# Altium schematic sheet Relay.SchDoc
size A4
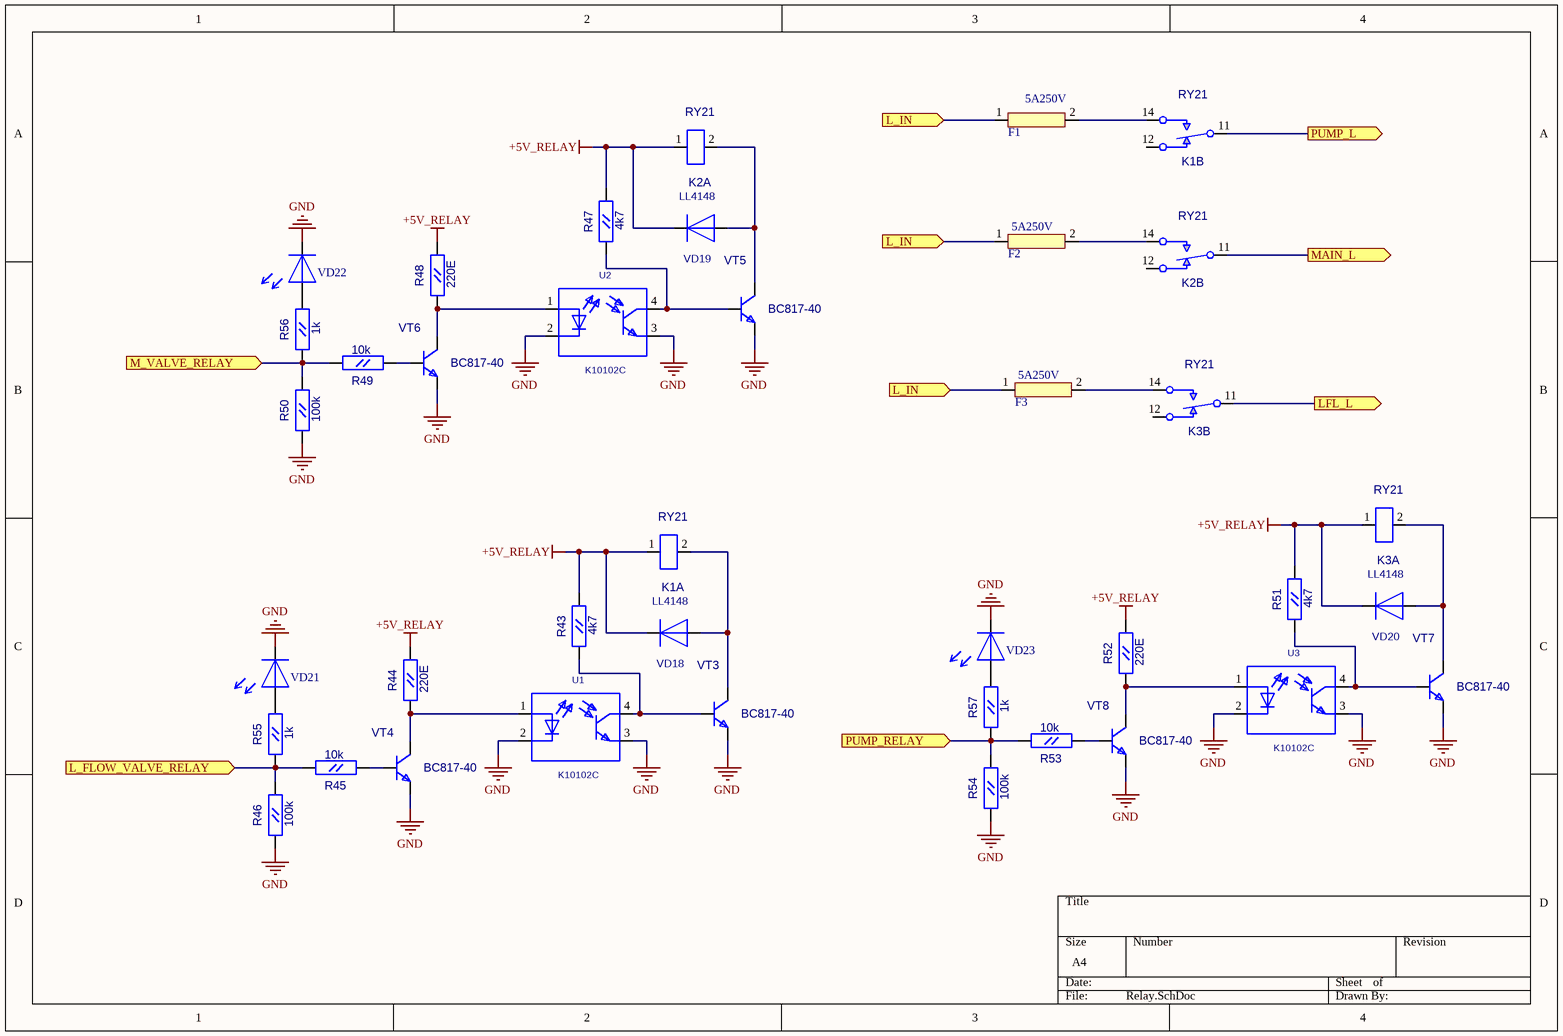
[diagram p0: Relay.SchDoc]

## Parts
F1  KLS5-266(5x20) 2pcs  [Fuse_5x20]  (value not drawn)
F2  KLS5-266(5x20) 2pcs  [Fuse_5x20]  (value not drawn)
F3  KLS5-266(5x20) 2pcs  [Fuse_5x20]  (value not drawn)
K1  RY21  [RY21_RY21(Primary)]  (parts A,B of 2)
K2  RY21  [RY21_RY21(Primary)]  (parts A,B of 2)
K3  RY21  [RY21_RY21(Primary)]  (parts A,B of 2)
R43  4k7  [RC0603]
R44  220E  [RC0603]
R45  10k  [RC0603]
R46  100k  [RC0603]
R47  4k7  [RC0603]
R48  220E  [RC0603]
R49  10k  [RC0603]
R50  100k  [RC0603]
R51  4k7  [RC0603]
R52  220E  [RC0603]
R53  10k  [RC0603]
R54  100k  [RC0603]
R55  1k  [RC0603]
R56  1k  [RC0603]
R57  1k  [RC0603]
U1  K10102C  [PC817]
U2  K10102C  [PC817]
U3  K10102C  [PC817]
VD18  LL4148  [SOD-80]
VD19  LL4148  [SOD-80]
VD20  LL4148  [SOD-80]
VD21  LED_0805  [LED0805]  (value not drawn)
VD22  LED_0805  [LED0805]  (value not drawn)
VD23  LED_0805  [LED0805]  (value not drawn)
VT3  BC817-40  [SOT-23(123)]
VT4  BC817-40  [SOT-23(123)]
VT5  BC817-40  [SOT-23(123)]
VT6  BC817-40  [SOT-23(123)]
VT7  BC817-40  [SOT-23(123)]
VT8  BC817-40  [SOT-23(123)]

## Ports
L_FLOW_VALVE_RELAY (in), L_IN (in), LFL_L (out), M_VALVE_RELAY (in), MAIN_L (out), PUMP_L (out), PUMP_RELAY (in)

## Nets
+5V_RELAY: K1.1(L1) K2.1(L1) K3.1(L1) R43.2(B) R44.2(B) R47.2(B) R48.2(B) R51.2(B) R52.2(B) VD18.2(+) VD19.2(+) VD20.2(+)
GND: R46.1(A) R50.1(A) R54.1(A) U1.2 U1.3 U2.2 U2.3 U3.2 U3.3 VD21.2 VD22.2 VD23.2 VT3.2(E) VT4.2(E) VT5.2(E) VT6.2(E) VT7.2(E) VT8.2(E)
L_FLOW_VALVE_RELAY: R45.2(B) R46.2(B) R55.1(A) ; port L_FLOW_VALVE_RELAY
L_IN: F1.1 F2.1 F3.1 ; port L_IN
LFL_L: K3.11(C1) ; port LFL_L
M_VALVE_RELAY: R49.2(B) R50.2(B) R56.1(A) ; port M_VALVE_RELAY
MAIN_L: K2.11(C1) ; port MAIN_L
PUMP_L: K1.11(C1) ; port PUMP_L
PUMP_RELAY: R53.2(B) R54.2(B) R57.1(A) ; port PUMP_RELAY
NetF1_2: F1.2 K1.14(C2)
NetF2_2: F2.2 K2.14(C2)
NetF3_2: F3.2 K3.14(C2)
NetK1_2: K1.2(C2) VD18.1(-) VT3.3(C)
NetK2_2: K2.2(C2) VD19.1(-) VT5.3(C)
NetK3_2: K3.2(C2) VD20.1(-) VT7.3(C)
NetR43_1: R43.1(A) U1.4 VT3.1(B)
NetR44_1: R44.1(A) U1.1 VT4.3(C)
NetR45_1: R45.1(A) VT4.1(B)
NetR47_1: R47.1(A) U2.4 VT5.1(B)
NetR48_1: R48.1(A) U2.1 VT6.3(C)
NetR49_1: R49.1(A) VT6.1(B)
NetR51_1: R51.1(A) U3.4 VT7.1(B)
NetR52_1: R52.1(A) U3.1 VT8.3(C)
NetR53_1: R53.1(A) VT8.1(B)
NetR55_2: R55.2(B) VD21.1
NetR56_2: R56.2(B) VD22.1
NetR57_2: R57.2(B) VD23.1

Not connected (* = marked no-connect by the designer): K1 12(C3); K2 12(C3); K3 12(C3)

## Notes on the sheet
- (near F1) 5A250V
- (near F2) 5A250V
- (near F3) 5A250V

## Library data of the parts
F1-F3 = Fuse KLS5-266(5x20): Value: KLS5-266(5x20) 2pcs
R43-R57 = RC0603
  R43 R47 R51: Value: 4k7
  R44 R48 R52: Value: 220E
  R45 R49 R53: Value: 10k
  R46 R50 R54: Value: 100k
  R55-R57: Value: 1k
VT3-VT8 = BC846BLT1: NPN 500ma transistor; ComponentField7: Published 29-Sep-2000; OriginalName: BC846BLT1; Value: BC817-40
K1-K3 = RY21: Value: *
U1-U3 = K10102C: Value: *
VD18-VD20 = LL4148: Value: *
VD21-VD23 = LED_0805: Value: LED_0805